# EAGLE design myf14 (EAGLE 6.2)
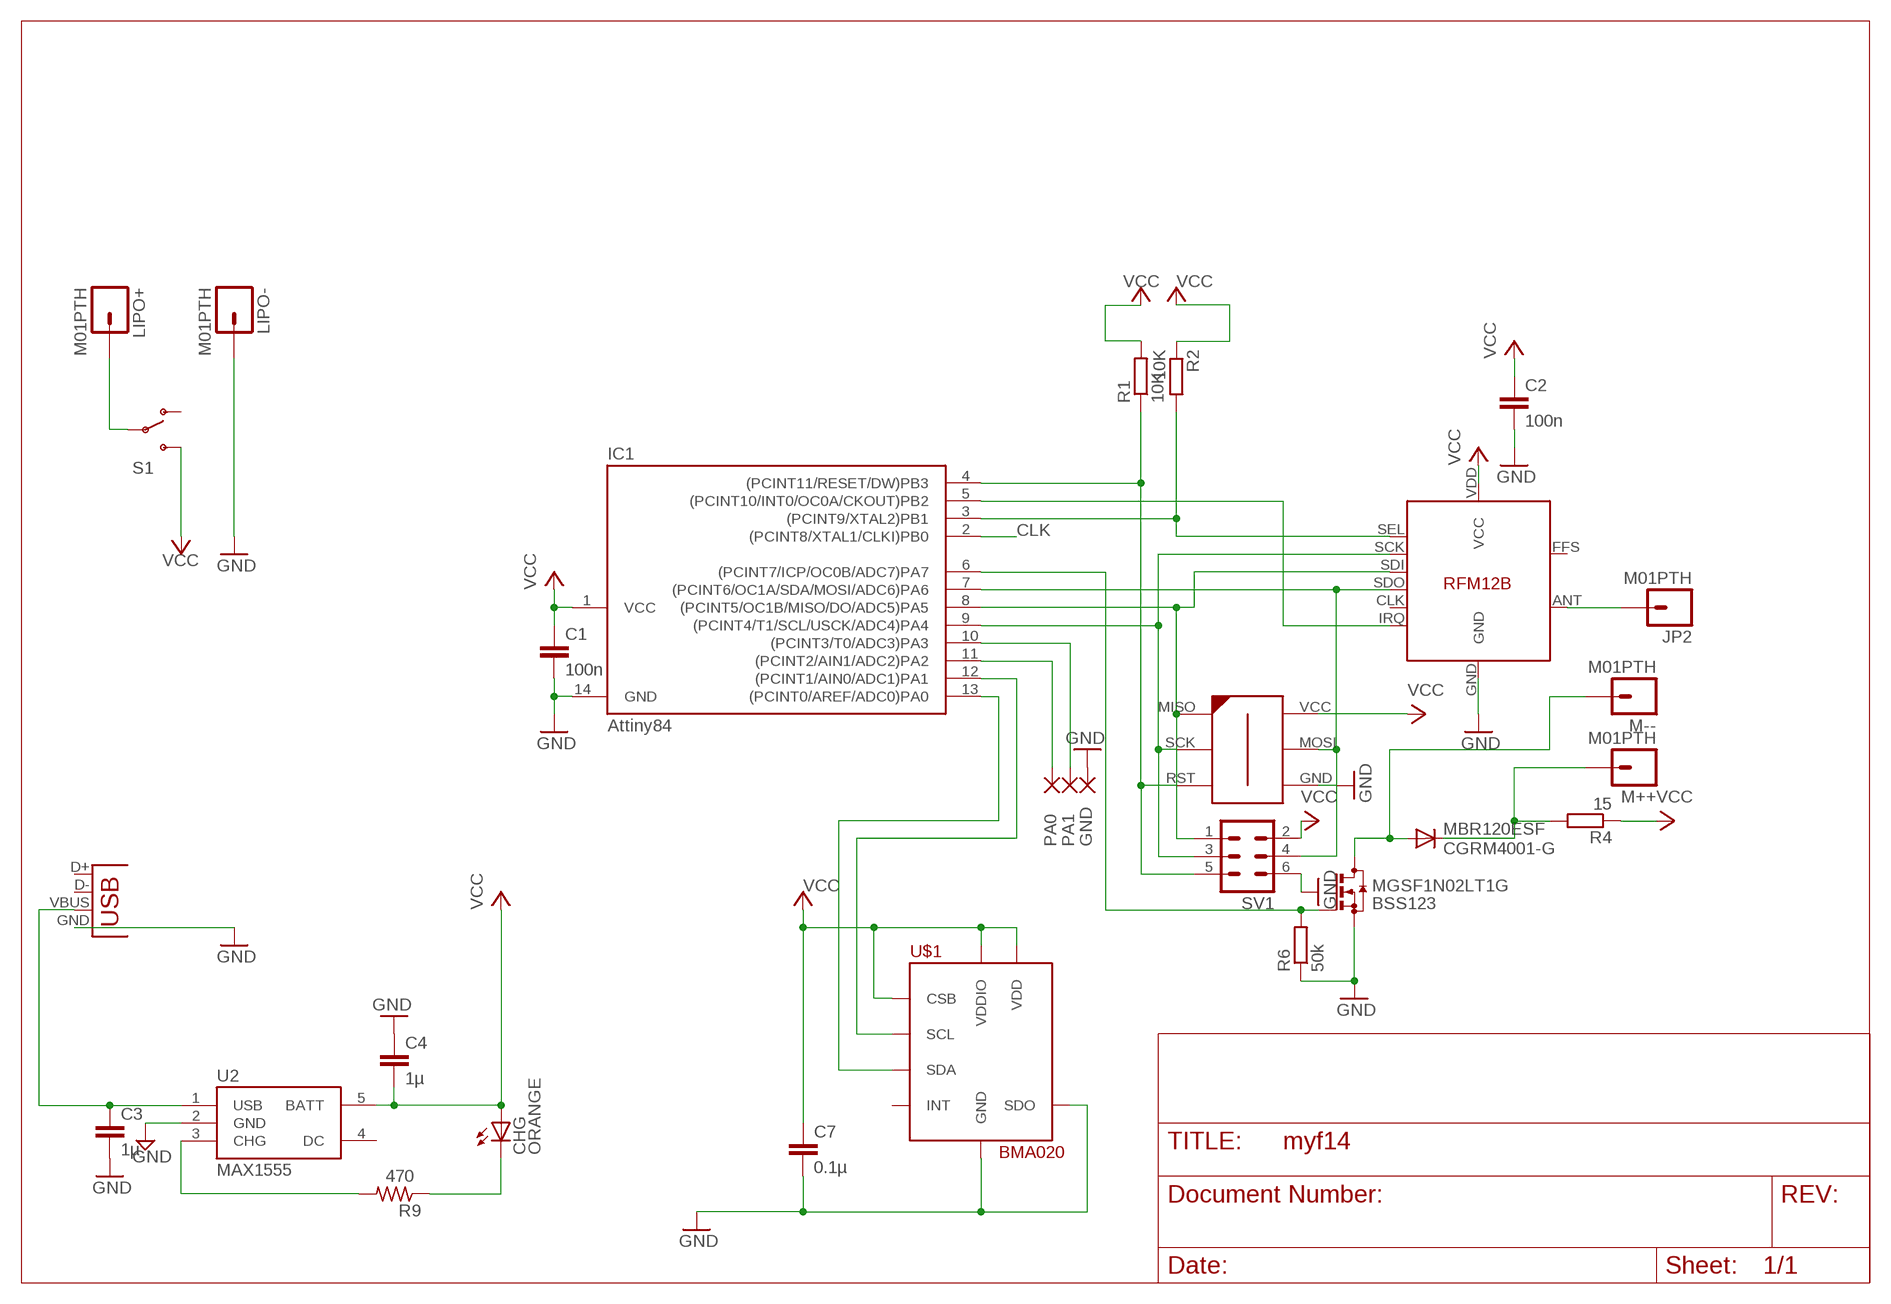
[diagram p0: schematic, sheet 1]

## Parts
C1  100n  C-EUC0603K  [C0603K]
C2  100n  C-EUC0603K  [C0603K]
C3  1µ  CAP0603-CAP  [0603-CAP]
C4  1µ  CAP0603-CAP  [0603-CAP]
C7  0.1µ  CAP0603-CAP  [0603-CAP]
CHG  ORANGE  LED0603  [LED-0603]
GND  SMD2  [SMD1,27-2,54]
IC1  Attiny84  TINY24/44/84-SSU  [SOIC14]
JP2  M01PTH  [1X01]
LIPO+  M01PTH  [1X01]
LIPO-  M01PTH  [1X01]
M++  M01PTH  [1X01]
M--  M01PTH  [1X01]
MBR120ESF  CGRM4001-G  [SOD-123_MINI-SMA]
MGSF1N02LT1G  BSS123  [SOT23]
PA0  SMD2  [SMD1,27-2,54]
PA1  SMD2  [SMD1,27-2,54]
R1  10K  R-EU_R0603  [R0603]
R2  10K  R-EU_R0603  [R0603]
R4  15  R-EU_R0603  [R0603]
R6  50k  R-EU_R0603  [R0603]
R9  470  R-US_R0603  [R0603]
RFM12B  RFM12B  [RFM12B]
S1  SWITCH-SPDTSMD  [AYZ0202]
SV1  MA03-2S  [MA03-2-0.8]
U2  MAX1555  [SOT23-5]
U$1  BMA020  [LBA-12]
U$2  AVR-ISP-6-EDGE  [6PAD_ISP]
X1  USB-MICROB  [USB-MICROB]

## Nets
CLK: IC1.2((PCINT8/XTAL1/CLKI)PB0)
GND: C1.2 C2.2 C3.2 C4.1 C7.2 GND.1(P) IC1.14(GND) LIPO-.1 MGSF1N02LT1G.2(S) R6.1 RFM12B.GND SV1.6 U2.2(GND) U$1.P$3(GND) U$1.P$7(SDO) U$2.GND X1.GND
LED: IC1.13((PCINT0/AREF/ADC0)PA0) U$1.P$8(SDA)
N$1: IC1.4((PCINT11/RESET/DW)PB3) R1.1 SV1.5 U$2.RST
N$2: IC1.3((PCINT9/XTAL2)PB1) R2.2 RFM12B.SEL
N$3: JP2.1 RFM12B.ANT
N$4: IC1.9((PCINT4/T1/SCL/USCK/ADC4)PA4) RFM12B.SCK SV1.3 U$2.SCK
N$5: IC1.8((PCINT5/OC1B/MISO/DO/ADC5)PA5) RFM12B.SDI SV1.1 U$2.MISO
N$6: IC1.7((PCINT6/OC1A/SDA/MOSI/ADC6)PA6) RFM12B.SDO SV1.4 U$2.MOSI
N$7: IC1.5((PCINT10/INT0/OC0A/CKOUT)PB2) RFM12B.IRQ
N$8: IC1.6((PCINT7/ICP/OC0B/ADC7)PA7) MGSF1N02LT1G.1(G) R6.2
N$9: IC1.10((PCINT3/T0/ADC3)PA3) PA1.1(P)
N$10: IC1.11((PCINT2/AIN1/ADC2)PA2) PA0.1(P)
N$11: IC1.12((PCINT1/AIN0/ADC1)PA1) U$1.P$6(SCL)
N$13: M++.1 MBR120ESF.C R4.2
N$14: M--.1 MBR120ESF.A MGSF1N02LT1G.3(D)
N$15: C3.1 U2.1(USB) X1.VBUS
N$16: LIPO+.1 S1.2(P)
N$23: CHG.C R9.1
N$26: R9.2 U2.3(CHG)
VCC: C1.1 C2.1 C4.2 C7.1 CHG.A IC1.1(VCC) R1.2 R2.1 R4.1 RFM12B.VDD(VCC) S1.3(S) SV1.2 U2.5(BATT) U$1.P$2(VDD) U$1.P$5(CSB) U$1.P$9(VDDIO) U$2.VCC
Unconnected: RFM12B.CLK RFM12B.FFS S1.1(O) U2.4(DC) U$1.P$4(INT) X1.D+ X1.D-

## Library data of the parts
C1 C2 = rcl:C-EU: CAPACITOR, European symbol
C3 C4 C7 = SparkFun:CAP: Capacitor Standard 0603 ceramic capacitor, and 0.1" leaded capacitor.
CHG = SparkFun:LED: LEDs Standard schematic elements and footprints for 5mm, 3mm, 1206, and 0603 sized LEDs. 5mm - Spark Fun Electronics SKU : COM-00529 (and others)
GND PA0 PA1 = wirepad:SMD2: SMD PAD
IC1 = avr-7:TINY24/44/84
JP2 LIPO+ LIPO- M++ M-- = SparkFun:M01: Header 1 Standard 1-pin 0.1" header. Use with straight break away headers (SKU : PRT-00116), right angle break away headers (PRT-00553), swiss pins (PRT-00743), machine pins (PRT-00117), and female headers (PRT-00115).
MBR120ESF = diode:CGRM400*-G: Molded plasitc,JEDEC SOD-123/Mini SMA Source: Comchip CGRM4001-G.pdf
MGSF1N02LT1G = transistor-small-signal:BSS123: N-CHANNEL MOS FET
R1 R2 R4 R6 = resistor:R-EU_: RESISTOR, European symbol
R9 = rcl:R-US_: RESISTOR, American symbol
RFM12B = JeeParts:RFM12B
S1 = SparkFun-Electromechanical:SWITCH-SPDT: SPDT Switch Simple slide switch, Spark Fun Electronics SKU : COM-00102 DPDT SMT slide switch, AYZ0202, SWCH-08179; PROD_ID: SWCH-08179
SV1 = JeeLabs:MA03-2: PIN HEADER
U2 = SparkFun:MAX1555: MAX1555 Lithium Charger IC SOT-23 Lithium Polymer charging IC. Schematic element and footprint proven. Spark Fun Electronics SKU : COM-00674
U$1 = JeeLabs:BMA020
U$2 = avr-7:AVR-ISP-6-EDGE: 6 pin edge connector for ISP with ATMEL MCUs. Developed by Craig Moates (craig at moates dot net). Library by David Blundell (blundar at gmail dot com). Often, even a 6 pin header is really inconvenient for board layout and/or production. This SMD-only header is our de-facto standard for using an edge connector for programming with the help of a 6pin/10pin to edge card adapter.
X1 = SparkFun:USB: USB Connectors USB-B-PTH is fully proven SKU : PRT-00139 USB-miniB is fully proven SKU : PRT-00587 USB-A-PCB is untested. USB-A-H is throughly reviewed, but untested. Spark Fun Electronics SKU : PRT-00437 USB-B-SMT is throughly reviewed, but untested. Needs silkscreen touching up. USB-A-S has not been used/tested USB-MB-H has not been used/tested

## Net classes
0 default: width 0.2 mm
1 power: width 0.305 mm

## Board
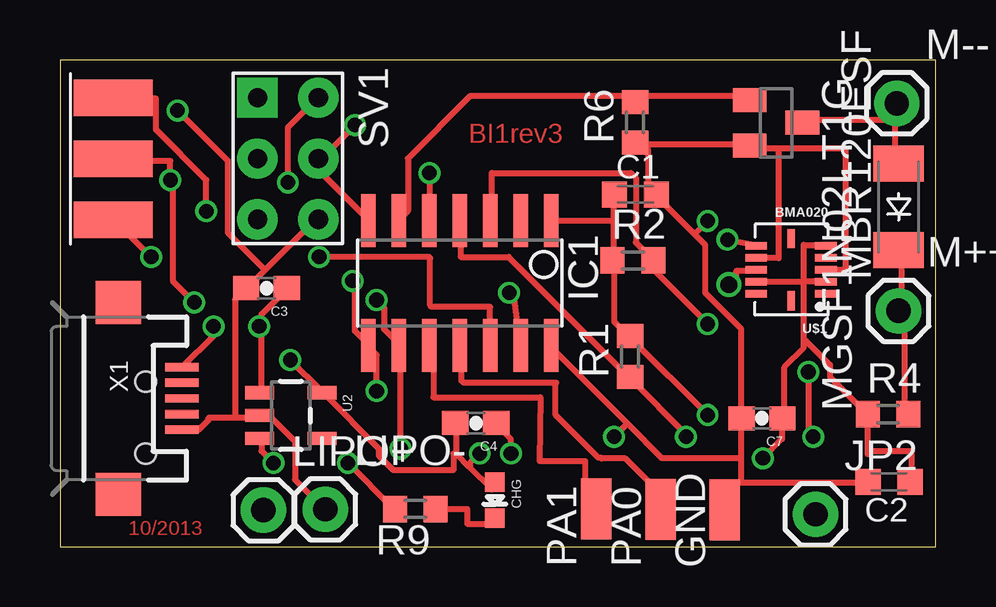
[diagram p1: board, top side]
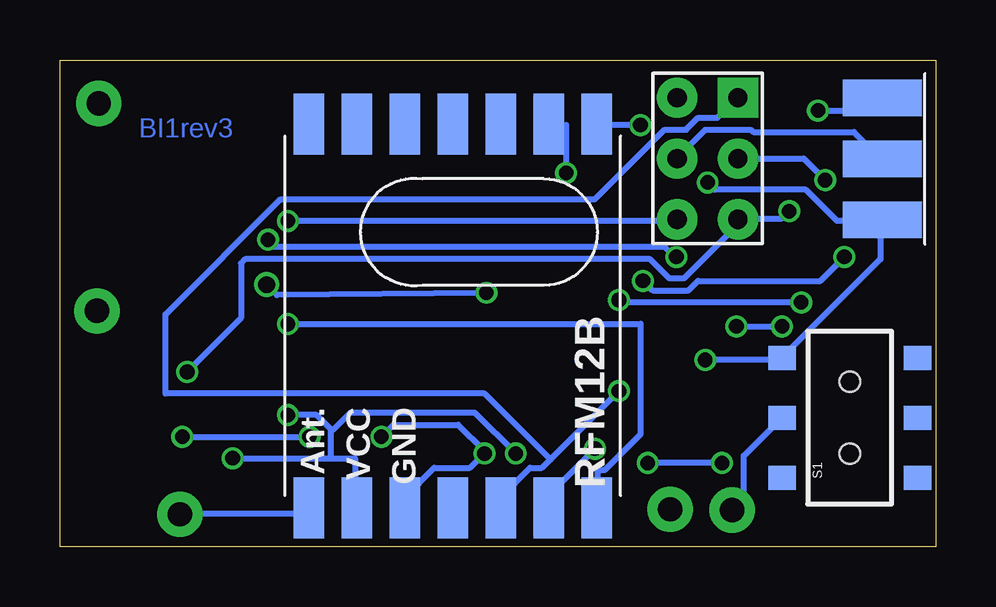
[diagram p2: board, bottom side, seen from below]

Size 36.5 x 20.31 mm. Coordinates in mm from the lower left corner, seen from the top.
Outline: 0,0 36.5,0 36.5,20.31 0,20.31 0,0
Copper layers (1*2*15*16): Top 0.035mm / dielectric 0.2mm / layer 2 0.0175mm / dielectric 1.1mm / layer 15 0.0175mm / dielectric 0.2mm / Bottom 0.035mm
Design rules: minimum track width 6mil, minimum drill 12mil, track to track 6mil, track to pad 6mil, pad to pad 6mil, via to via 6mil, smd to smd 0mil, copper to edge 10mil, drill to drill 10mil, minimum pad ring 6mil, minimum via ring 6mil, stop-mask expansion 2mil, vias tented up to drill 25mil, thermal gap 10mil

### Footprints (pad centres in the part's own frame; a part is rotated, then mirrored left to right if it is on the bottom)
C0603K = smd 1.05 x 1.08: 1 -0.875,0; 2 0.875,0
0603-CAP = smd 1.1 x 1: 1 -0.85,0; 2 0.85,0
LED-0603 = smd 0.8 x 0.8: A 0,-0.75; C 0,0.75
SMD1,27-2,54 = smd 1.27 x 2.54: 1 0,0
SOIC14 = smd 0.61 x 2.21: 1 -3.81,-2.603; 2 -2.54,-2.603; 3 -1.27,-2.603; 4 0,-2.603; 5 1.27,-2.603; 6 2.54,-2.603; 7 3.81,-2.603; 8 3.81,2.603; 9 2.54,2.603; 10 1.27,2.603; 11 0,2.603; 12 -1.27,2.603; 13 -2.54,2.603; 14 -3.81,2.603
1X01 = drill 1.016 pad 1.88: 1 0,0
SOD-123_MINI-SMA = smd 1.5 x 2.1: A 1.8,0; C -1.8,0
SOT23 = smd 1 x 1.4: 1 -0.95,-1.1; 2 0.95,-1.1; 3 0,1.1
R0603 = smd 1 x 1.1: 1 -0.85,0; 2 0.85,0
RFM12B = smd 2.54 x 1.27: ANT 8,-6; CLK -8,-2; FFS -8,2; GND 8,-2; IRQ -8,4; P$8 -8,0; P$10 -8,-4; P$12 -8,-6; P$16 8,0; SCK 8,4; SDI 8,2; SDO -8,6; SEL 8,6; VDD 8,-4
AYZ0202 = smd 1 x 1.15: 1 -2.5,2.825; 2 0,2.825; 3 2.5,2.825; 4 -2.5,-2.825; 5 0,-2.825; 6 2.5,-2.825 | hole 0.85: 1.5,0; -1.5,0
MA03-2-0.8 = drill 0.8 pad 1.676 square: 1 -2.54,-1.27 | drill 0.8 pad 1.676: 2 -2.54,1.27; 3 0,-1.27; 4 0,1.27; 5 2.54,-1.27; 6 2.54,1.27
SOT23-5 = smd 0.55 x 1.2: 1 -0.95,-1.3; 2 0,-1.3; 3 0.95,-1.3; 4 0.95,1.3; 5 -0.95,1.3
LBA-12 = smd 0.9 x 0.32: P$1 -1.45,1; P$2 -1.45,0.5; P$3 -1.45,0; P$4 -1.45,-0.5; P$5 -1.45,-1; P$6 1.45,-1; P$7 1.45,-0.5; P$8 1.45,0; P$9 1.45,0.5; P$10 1.45,1 | smd 0.32 x 0.8: P$11 0,1.3; P$12 0,-1.3
6PAD_ISP = smd 1.524 x 3.302 bottom: GND 2.54,0; MOSI 0,0; VCC -2.54,0 | smd 1.524 x 3.302: MISO -2.54,0; RST 2.54,0; SCK 0,0
USB-MICROB = smd 0.35 x 1.4: D+ 0,2.65; D- -0.65,2.65; GND 1.3,2.65; ID 0.65,2.65; VBUS -1.3,2.65 | smd 1.8 x 1.9: MT1 -4,0; MT2 4,0

### Placement (x,y rotation side)
C1  23.99,14.7 0 top
C2  34.56,2.71 180 top
C3  8.61,10.79 180 top
C4  17.34,5.17 180 top
C7  29.27,5.37 180 top
CHG  18.13,1.96 180 top
GND  27.71,1.54 0 top
IC1  16.67,11 180 top
JP2  31.5,1.36 0 top
LIPO+  8.48,1.54 0 top
LIPO-  11.06,1.57 0 top
M++  34.96,9.85 0 top
M--  34.89,18.5 0 top
MBR120ESF  34.97,14.19 90 top
MGSF1N02LT1G  29.85,17.69 270 top
PA0  25.04,1.57 0 top
PA1  22.34,1.58 0 top
R1  23.76,7.94 90 top
R2  23.88,11.95 0 top
R4  34.52,5.54 0 top
R6  23.97,17.71 90 top
R9  14.81,1.58 180 top
RFM12B  20.13,9.64 270 bottom
S1  3.58,5.39 90 bottom
SV1  9.5,16.2 270 top
U2  9.62,5.48 270 top
U$1  30.48,11.57 180 top
U$2  2.22,16.19 90 top
X1  2.43,6.19 270 top

### Tracks (layer width: path | path; a pad name or v marks a point on that pad's centre or on a via)
GND  (via drill 0.61)
  Top 0.254: v18.8,3.9 18.8,4.5 18.2,5.1 C4.1 | 28.4,2.7 27.8,2.7 27.8,1.6 GND.1 | 28.4,2.7 33.6,2.7 C2.2 | 28.4,2.7 28.4,3.7 | 28.4,3.7 28.4,5.3 C7.2 28.4,5.5 28.4,9.1 26.9,10.6 26.9,12.6 26.45,13.05 | 23.65,5.15 25.1,3.7 28.4,3.7 | 23.65,5.15 20.5,8.3 IC1.14 | 26.45,13.05 24.9,14.6 C1.2 24.8,14.8 24.5,15.1 24.5,16.6 24,17.1 R6.1 24.4,16.8 28.6,16.8 MGSF1N02LT1G.2 28.7,16.61 30.03,16.61 | 23.65,5.15 v23.1,4.6 | 7.3,5.4 6.2,5.4 6.2,5.3 5.8,4.9 5.1,4.9 X1.GND | 7.3,5.4 8.3,5.4 U2.2 8.4,5.4 8.8,5.4 9.8,4.4 9.8,2.8 11,1.6 LIPO-.1 | 8.55,11.55 10.7,13.7 SV1.6 | 8.55,11.55 7.8,10.8 C3.2 7.7,10.7 7.3,10.3 7.3,5.4 | v4.9,18.2 7,16.1 7,13.1 8.55,11.55 | v27,13.6 26.45,13.05 | U$1.P$3 32.75,11.57 32.75,16.61 30.03,16.61 | U$1.P$7 29.94,12.07 29.96,12.04 29.96,16.54 30.03,16.61
  Bottom 0.254: RFM12B.GND 22.1,1.7 22.1,2.1 20.9,3.3 19.4,3.3 v18.8,3.9 18.8,4 19.9,5.1 22.6,5.1 v23.1,4.6 | v4.9,18.2 2.8,18.2 2.3,18.7 U$2.GND | v27,13.6 10.8,13.6 SV1.6
LED  (via drill 0.6 pad 0.25, 0.69)
  Top 0.254: v27.89,10.94 28.2,10.94 28.2,11.52 29.03,11.52 U$1.P$8 | IC1.13 18.95,10.33 v18.72,10.6
  Bottom 0.254: v27.89,10.94 27.45,10.51 v18.72,10.6
N$1  (via drill 0.61)
  Top 0.254: IC1.4 16.7,13.6 16.7,12.1 18.7,12.1 23.7,7.1 R1.1 23.8,7 26.1,4.7 v26.1,4.6 | v6.1,14 6.1,15.3 4,17.4 4,18.7 2.3,18.7 U$2.RST | v31.4,4.6 31.2,4.8 v31.2,7.3
  Bottom 0.254: v6.1,14 6.4,13.7 8.2,13.7 SV1.5 8.1,13.6 10.5,11.2 11.1,11.2 11.9,12 28.78,12 28.95,11.83 28.95,9.55 v31.2,7.3 | v31.4,4.6 v26.1,4.6
N$2  (via drill 0.61)
  Top 0.254: IC1.3 18,13.7 18,15.6 23.8,15.6 24,15.4 24,12.7 24.7,12 R2.2 24.8,11.9 24.8,11.5 v27,9.3
  Bottom 0.254: v27,9.3 12.3,9.3 12.3,4.7 13.8,3.2 14.1,3.2 14.1,1.7 RFM12B.SEL
N$3
  Bottom 0.254: RFM12B.ANT 26.2,1.6 26.4,1.4 31.4,1.4 JP2.1
N$4  (via drill 0.61)
  Top 0.254: v14.2,4.1 14.2,8.3 IC1.9 14.1,8.5 13.5,9.1 13.5,10 v13.2,10.3 | U$2.SCK 2.3,16.1 4.6,16.1 v4.6,15.3 4.7,15.3 4.7,11.1 v5.6,10.2
  Bottom 0.254: v14.2,4.1 16.1,2.2 16.1,1.7 RFM12B.SCK | v4.6,15.3 5.5,16.2 8.2,16.2 SV1.3 | v13.2,10.3 13.1,10.2 v5.6,10.2
N$5  (via drill 0.61)
  Top 0.254: v13.2,6.5 13.2,8 12.9,8.3 IC1.8 12.8,8.5 12.3,9 12.3,11 v12.2,11.1 | v3.8,12.1 2.3,13.6 U$2.MISO
  Bottom 0.254: 16.05,3.65 16.4,3.3 16.9,3.3 18.1,2.1 18.1,1.7 RFM12B.SDI | 16.05,3.65 v13.2,6.5 | v3.8,12.1 4.8,11.1 9.9,11.1 10.3,10.7 11.8,10.7 v12.2,11.1 | 16.05,3.65 18.8,6.4 32.1,6.4 32.1,9.7 27.3,14.5 14.2,14.5 11.3,17.4 10.4,17.4 9.9,17.9 9.1,17.9 8.3,18.7 SV1.1
N$6  (via drill 0.61)
  Top 0.254: IC1.7 12.8,13.7 10.8,15.7 10.8,16.2 SV1.4 10.9,16.2 v12.3,17.6
  Bottom 0.254: v12.3,17.6 14.1,17.6 RFM12B.SDO | U$2.MOSI 2.3,16.2 3.4,17.3 7.6,17.3 7.7,17.4 9.6,17.4 10.7,16.3 SV1.4
N$7  (via drill 0.61)
  Top 0.254: v15.4,15.6 15.4,13.7 IC1.5
  Bottom 0.254: v15.4,15.6 15.4,17.6 16.1,17.6 RFM12B.IRQ
N$8
  Top 0.254: MGSF1N02LT1G.1 28.6,18.8 24,18.8 R6.2 23.9,18.8 17.1,18.8 14.5,16.2 14.5,14 14.2,13.7 IC1.6
N$9
  Top 0.254: IC1.10 15.54,8.4 15.57,6.25 20.02,6.25 19.99,3.59 21.89,3.59 21.89,2.62 22.34,2.62 PA1.1
N$10
  Top 0.254: PA0.1 25.04,2.23 23.58,3.69 22.59,3.69 22.55,3.72 22.45,3.72 20.66,5.51 20.66,6.81 20.69,6.84 16.84,6.84 16.74,6.94 16.74,8.32 IC1.11
N$11  (via drill 0.61)
  Top 0.254: v27.83,12.82 29,12.6 U$1.P$6 | v10.8,12.1 15.38,12.1 15.43,12.05 15.43,10.08 15.5,10.01 17.92,10.01 17.94,10 IC1.12
  Bottom 0.254: v27.83,12.82 27.7,12.5 11.3,12.5 10.9,12.1 v10.8,12.1
N$13
  Top 0.254: R4.2 35.3,5.6 35.2,5.7 35.2,10 M++.1 35.1,10.1 35.1,12.2 35,12.3 MBR120ESF.C
N$14
  Top 0.254: MGSF1N02LT1G.3 30.9,17.8 34.8,17.8 34.8,18.4 M--.1 34.8,17.7 34.8,16.1 34.9,16 MBR120ESF.A
N$15  (via drill 0.61)
  Top 0.254: 8.4,9.2 8.4,6.5 U2.1 | 8.4,9.2 8.4,9.7 9.4,10.7 C3.1 | v6.4,9.2 6.4,8.8 5.1,7.5 X1.VBUS | v8.3,9.2 8.4,9.2
  Bottom 0.254: v8.3,9.2 v6.4,9.2
N$16
  Bottom 0.254: S1.2 6.5,5.3 8,3.8 8,1.6 8.4,1.6 LIPO+.1
N$23
  Top 0.254: R9.1 16.97,1.58 16.97,0.97 18.04,0.97 CHG.C
N$26  (via drill 0.61)
  Top 0.254: v12,3.5 13.9,1.6 R9.2 | v8.9,3.5 8.4,4 8.4,4.5 U2.3
  Bottom 0.254: v8.9,3.5 v12,3.5
VCC  (via drill 0.61)
  Top 0.254: 23.1,13.6 23.1,12 R2.1 23.1,11.9 23.1,9.4 23.7,8.8 R1.2 23.8,8.7 v27,5.5 | 23.1,13.6 C1.1 | 23.1,13.6 20.5,13.6 IC1.1 | 31,8.6 31,8.3 30.2,7.5 30.2,5.4 C7.1 30.1,5.3 30.1,4.5 v29.3,3.7 | 31,8.6 31,11.07 | 31,11.07 31,12.6 31.9,12.6 U$1.P$5 | 31,8.6 31.1,8.6 32.1,7.6 32.1,7.1 33.6,5.6 R4.1 33.67,3.88 33.72,3.88 33.72,3.99 35.51,3.99 35.51,2.71 C2.1 | 16.5,3.9 17.05,3.35 | 17.05,3.35 18,2.4 CHG.A | 16.5,3.9 16.5,5.1 C4.2 | 16.5,3.9 16.4,3.9 16.4,3.2 13.9,3.2 13.3,3.8 13.3,4.1 11,6.4 U2.5 10.9,6.5 v9.6,7.8 | v9.5,15.2 9.5,17.5 10.7,18.7 SV1.2 | v17.5,3.9 17.1,3.5 17.1,3.4 17.05,3.35 | U$1.P$9 31,11.07 | U$1.P$2 31,11.07
  Bottom 0.254: v29.3,3.7 25.2,3.7 | 25.2,3.7 24.2,3.7 24.2,1.7 RFM12B.VDD | v27,5.5 25.8,5.5 25.2,4.9 | 25.2,3.7 25.2,4.9 | v9.5,15.2 9.2,14.9 5.4,14.9 4.1,13.6 2.4,13.6 U$2.VCC 2.3,13.6 2.3,12 S1.3 6.5,7.8 v9.6,7.8 | v17.5,3.9 19.2,5.6 24.4,5.6 25.1,4.9 25.2,4.9

### Text on the board
Top: BI1rev3 | 10/2013
Bottom: BI1rev3